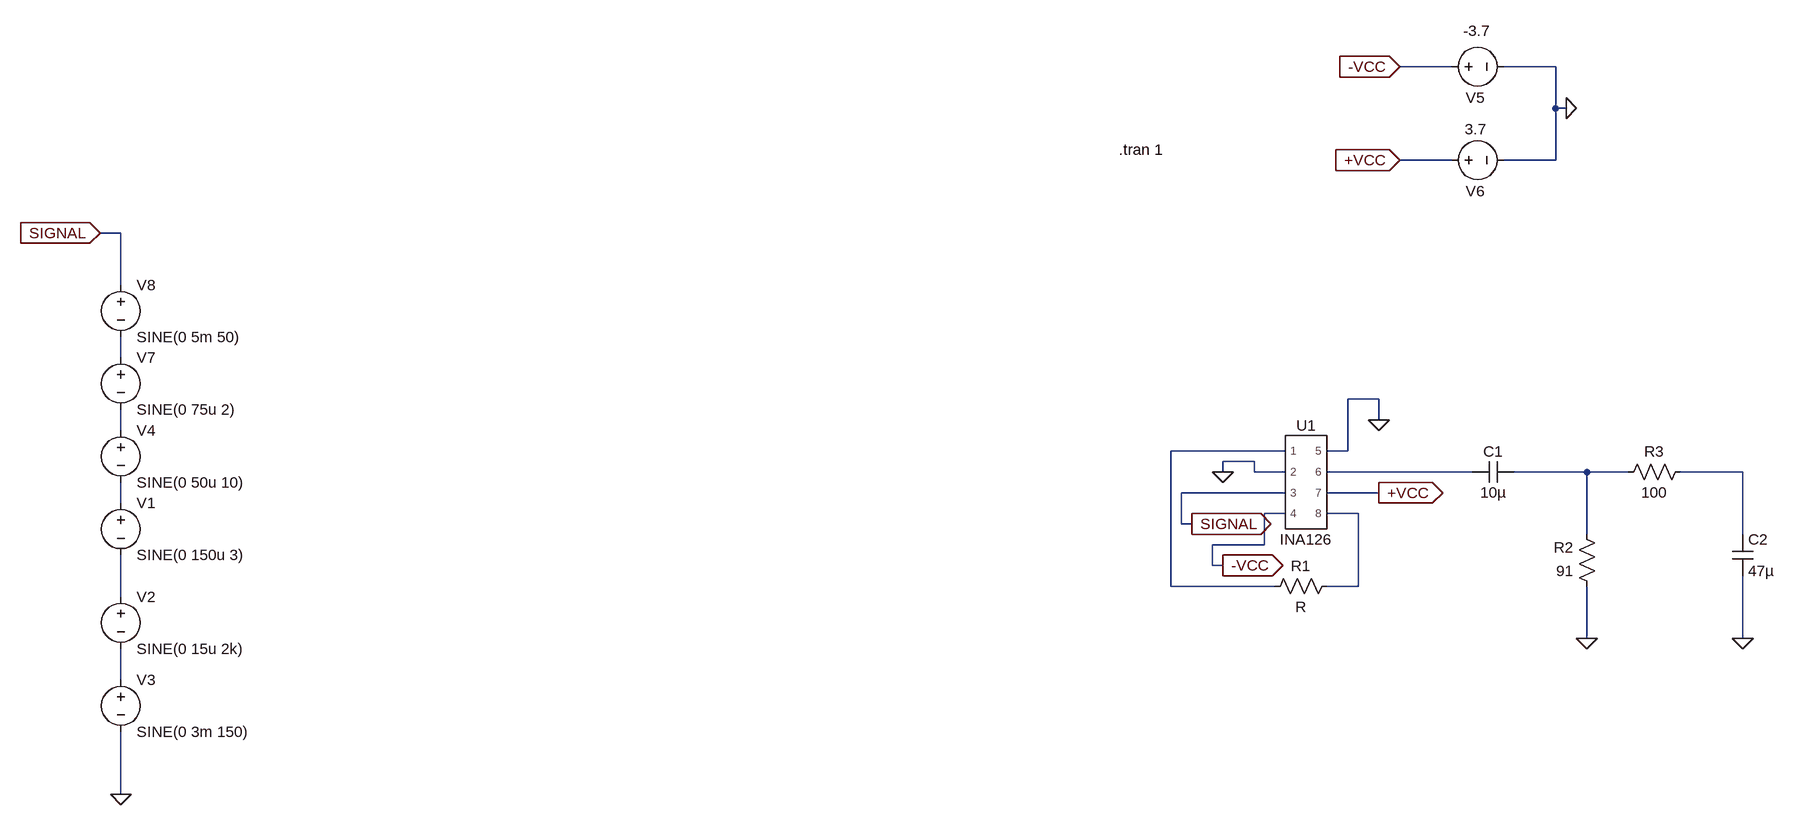
[diagram p0: schematic lteeg_v1.asc]
lteeg_v1.asc, the LTspice schematic file:
Version 4.1
SHEET 1 2408 1364
WIRE 928 -720 848 -720
WIRE 1088 -720 1008 -720
WIRE 1088 -656 1088 -720
WIRE 1104 -656 1088 -656
WIRE 928 -576 848 -576
WIRE 1088 -576 1088 -656
WIRE 1088 -576 1008 -576
WIRE -1120 -464 -1152 -464
WIRE -1120 -384 -1120 -464
WIRE -1120 -272 -1120 -304
WIRE 816 -208 768 -208
WIRE 816 -176 816 -208
WIRE -1120 -160 -1120 -192
WIRE 672 -128 496 -128
WIRE 768 -128 768 -208
WIRE 768 -128 736 -128
WIRE 624 -112 576 -112
WIRE 576 -96 576 -112
WIRE 624 -96 624 -112
WIRE 672 -96 624 -96
WIRE 960 -96 736 -96
WIRE 1136 -96 1024 -96
WIRE 1200 -96 1136 -96
WIRE 1376 -96 1280 -96
WIRE 672 -64 512 -64
WIRE 816 -64 736 -64
WIRE -1120 -48 -1120 -80
WIRE 672 -32 640 -32
WIRE 784 -32 736 -32
WIRE 512 -16 512 -64
WIRE 528 -16 512 -16
WIRE 1136 0 1136 -96
WIRE 1376 0 1376 -96
WIRE 640 16 640 -32
WIRE 640 16 560 16
WIRE 560 48 560 16
WIRE 576 48 560 48
WIRE 496 80 496 -128
WIRE 656 80 496 80
WIRE 784 80 784 -32
WIRE 784 80 736 80
WIRE -1120 96 -1120 32
WIRE 1136 160 1136 80
WIRE 1376 160 1376 64
WIRE -1120 224 -1120 176
WIRE -1120 400 -1120 304
FLAG 1136 160 0
FLAG 1376 160 0
FLAG 1104 -656 0
FLAG 848 -576 +VCC
IOPIN 848 -576 In
FLAG 848 -720 -VCC
IOPIN 848 -720 In
FLAG 816 -64 +VCC
IOPIN 816 -64 Out
FLAG 576 48 -VCC
IOPIN 576 48 Out
FLAG 816 -176 0
FLAG -1120 400 0
FLAG -1152 -464 SIGNAL
IOPIN -1152 -464 In
FLAG 528 -16 SIGNAL
IOPIN 528 -16 Out
FLAG 576 -96 0
SYMBOL voltage -1120 -64 R0
WINDOW 123 0 0 Left 0
WINDOW 39 0 0 Left 0
SYMATTR InstName V1
SYMATTR Value SINE(0 150u 3)
SYMBOL voltage -1120 80 R0
WINDOW 123 0 0 Left 0
WINDOW 39 0 0 Left 0
SYMATTR InstName V2
SYMATTR Value SINE(0 15u 2k)
SYMBOL voltage -1120 208 R0
WINDOW 123 0 0 Left 0
WINDOW 39 0 0 Left 0
SYMATTR InstName V3
SYMATTR Value SINE(0 3m 150)
SYMBOL voltage -1120 -176 R0
WINDOW 123 0 0 Left 0
WINDOW 39 0 0 Left 0
SYMATTR InstName V4
SYMATTR Value SINE(0 50u 10)
SYMBOL res 752 64 R90
WINDOW 0 0 56 VBottom 2
WINDOW 3 32 56 VTop 2
SYMATTR InstName R1
SYMBOL voltage 912 -720 R270
WINDOW 123 0 0 Left 0
WINDOW 39 0 0 Left 0
WINDOW 0 -48 38 VRight 2
WINDOW 3 55 34 VRight 2
SYMATTR InstName V5
SYMATTR Value -3.7
SYMBOL voltage 912 -576 R270
WINDOW 0 -48 38 VRight 2
WINDOW 3 48 36 VRight 2
WINDOW 123 0 0 Left 0
WINDOW 39 0 0 Left 0
SYMATTR InstName V6
SYMATTR Value 3.7
SYMBOL voltage -1120 -288 R0
WINDOW 123 0 0 Left 0
WINDOW 39 0 0 Left 0
SYMATTR InstName V7
SYMATTR Value SINE(0 75u 2)
SYMBOL voltage -1120 -400 R0
WINDOW 123 0 0 Left 0
WINDOW 39 0 0 Left 0
SYMATTR InstName V8
SYMATTR Value SINE(0 5m 50)
SYMBOL res 1152 96 R180
WINDOW 0 36 76 Left 2
WINDOW 3 36 40 Left 2
SYMATTR InstName R2
SYMATTR Value 91
SYMBOL cap 1024 -112 R90
WINDOW 0 0 32 VBottom 2
WINDOW 3 32 32 VTop 2
SYMATTR InstName C1
SYMATTR Value 10µ
SYMBOL res 1296 -112 R90
WINDOW 0 0 56 VBottom 2
WINDOW 3 32 56 VTop 2
SYMATTR InstName R3
SYMATTR Value 100
SYMBOL cap 1360 0 R0
SYMATTR InstName C2
SYMATTR Value 47µ
SYMBOL INA126 704 -80 R0
SYMATTR InstName U1
TEXT 416 -592 Left 2 !.tran 1

The netlist it stands for:
* lteeg_v1.asc
V1 N007 N009 SINE(0 150u 3)
V2 N009 N010 SINE(0 15u 2k)
V3 N010 0 SINE(0 3m 150)
V4 N002 N007 SINE(0 50u 10)
R1 N008 N003 R
V5 -VCC 0 -3.7
V6 +VCC 0 3.7
V7 N001 N002 SINE(0 75u 2)
V8 SIGNAL N001 SINE(0 5m 50)
R2 0 N005 91
C1 N005 N004 10µ
R3 N006 N005 100
C2 N006 0 47µ
X§U1 N003 0 SIGNAL -VCC 0 N004 +VCC N008 INA126  ; pins 1 2 3 4 5 6 7 8
.tran 1
.lib Z:\20221750037\Downloads\sbom210a\INA126_TINA_AIO\INA126.LIB
.backanno
.end